# Altium project MainBay_v2.2.PrjPCB
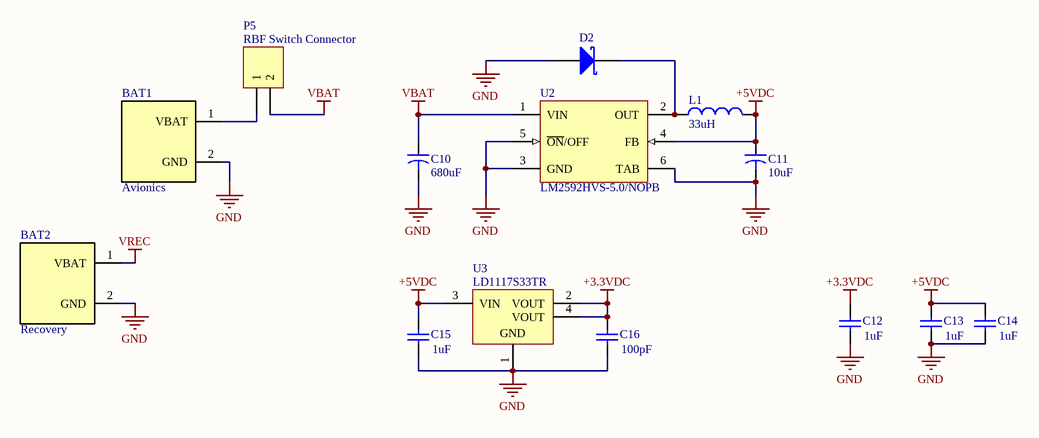
[diagram p0: PowerSys.SchDoc]
3 sheets, 55 parts. Net scope: global (net labels, ports and power ports of the same name join across sheets).
Board file: MainBay_v2.2_PCB.PcbDoc
Sheets:
  PowerSys.SchDoc
  Microcontroller.SchDoc
  Sensors.SchDoc

## Sheet PowerSys.SchDoc: Power Regulation
size A4; Revision: 2.2

### Parts
BAT1  Avionics  [XT30]
BAT2  Recovery  [XT30]
C10  value 680uF  [*CAPAE430X550N]  (hidden comment: Cap2)
C11  value 10uF  [*CAPAE430X550N]  (hidden comment: Cap2)
C12  value 1uF  [1608[0603]]  (hidden comment: Cap Semi)
C13  value 1uF  [1608[0603]]  (hidden comment: Cap Semi)
C14  value 1uF  [1608[0603]]  (hidden comment: Cap Semi)
C15  value 1uF  [C1206]  (hidden comment: Cap Semi)
C16  value 100pF  [C1206]  (hidden comment: Cap Semi)
D2  D Schottky  [SMB]  (value not drawn)
L1  33uH  [Inductor]
P5  RBF Switch Connector  [HDR1X2]
U2  LM2592HVS-5.0/NOPB  [TS5B_N]
U3  LD1117S33TR  [SOT-223_N]

### Nets
+3.3VDC: C12.2 C16.2 U3.2(VOUT) U3.4(VOUT)
+5VDC: C11.1 C13.2 C14.2 C15.2 L1.1 U2.4(FB) U3.3(VIN)
GND: BAT1.2(GND) BAT2.2(GND) C10.2 C11.2 C12.1 C13.1 C14.1 C15.1 C16.1 D2.1(A) U2.3(GND) U2.5(~{ON}/OFF) U2.6(TAB) U3.1(GND)
VBAT: C10.1 P5.2 U2.1(VIN)
VREC: BAT2.1(VBAT)
NetBAT1_1: BAT1.1(VBAT) P5.1
NetD2_2: D2.2(K) L1.2 U2.2(OUT)

### Library data of the parts
BAT1 BAT2 = XT30
C10 C11 = Cap2: Capacitor; Published: 23-Sep-2002; PackageReference: CAPR5-4X5; Publisher: Altium Limited; PackageDescription: Capacitor; 2 Leads
C12-C16 = Cap Semi: Capacitor (Semiconductor SIM Model); Published: 8-Jun-2000; LatestRevisionDate: 29-May-2009; LatestRevisionNote: IPC-7351 Footprint Added.; PackageReference: C1206; Publisher: Altium Limited; PackageDescription: Chip Capacitor
D2 = D Schottky: Schottky Diode; Published: 8-Jun-2000; LatestRevisionDate: 17-Jul-2002; LatestRevisionNote: Re-released for DXP Platform.; PackageReference: SMB; Publisher: Altium Limited; PackageDescription: DO-214-AA/SMB; 2 C-Bend Leads; Body 5.3 x 3.6 mm, inc. leads (LxW); Code_JEDEC: DO-214-AA
L1 = Inductor
P5 = Header 2: Header, 2-Pin; LatestRevisionDate: 17-Jul-2002; LatestRevisionNote: Re-released for DXP Platform.; Publisher: Altium Limited
U2 = LM2592HVS-5.0/NOPB: SIMPLE SWITCHER® Power Converter 150 KHz 2A Step-Down Voltage Regulator, 5-pin TO-263, Pb-Free; Manufacturer: National Semiconductor; PackageTopMarking: NSUZXYTTE#*LM2592HVS*-5.0 P+; PowerWise: N; Published: 1-Mar-2010; DatasheetVersion: Aug-2001; PackageVersion: revD, Apr-2005; PackageReference: TS5B; Publisher: Altium Limited; PackageDescription: TO-263, Molded, .400 x .390 x .180in, 5 Lead, .067in Pitch, Surface Mount; Supplier 1: Digi-Key; Supplier Part Number 1: LM2592HVS-5.0-ND; Supplier 2: Farnell; Supplier Part Number 2: 1469187; PartNumber: LM2592HVS-5.0/NOPB; RoHS: Y; PinCount: 5; CompType: Switcher; Code_JEDEC: MO-169-AB; ComponentLink1Description: LM2592HV Datasheet; ComponentLink1URL: http://www.national.com/ds/LM/LM2592HV.pdf; ComponentLink2Description: LM2592HV Web Page; ComponentLink2URL: http://www.national.com/pf/LM/LM2592HV.html; ComponentLink3Description: TS5B Package Page; ComponentLink3URL: http://www.national.com/packaging/folders/ts5b.html
U3 = LD1117S33TR: Fixed Low Drop Positive Voltage Regulator, 3.3V, 4-Pin SOT-223, Tape and Reel; DatasheetVersion: Nov-2011; PackageVersion: 2010; PackageReference: SOT-223; PackageDescription: 4-Pin SOT-223 Package, 6.5 x 3.5 mm Body, 2.3 mm Pitch, 7 mm Lead Span; PartNumber: LD1117S33TR; ComponentLink1Description: Manufacturer URL; ComponentLink1URL: http://www.st.com; ComponentLink2Description: Datasheet; ComponentLink2URL: http://www.st.com/internet/com/TECHNICAL_RESOURCES/TECHNICAL_LITERATURE/DATASHEET/CD00000544.pdf

## Sheet Microcontroller.SchDoc: Microcontroller Base
size A4; Revision: 2.2
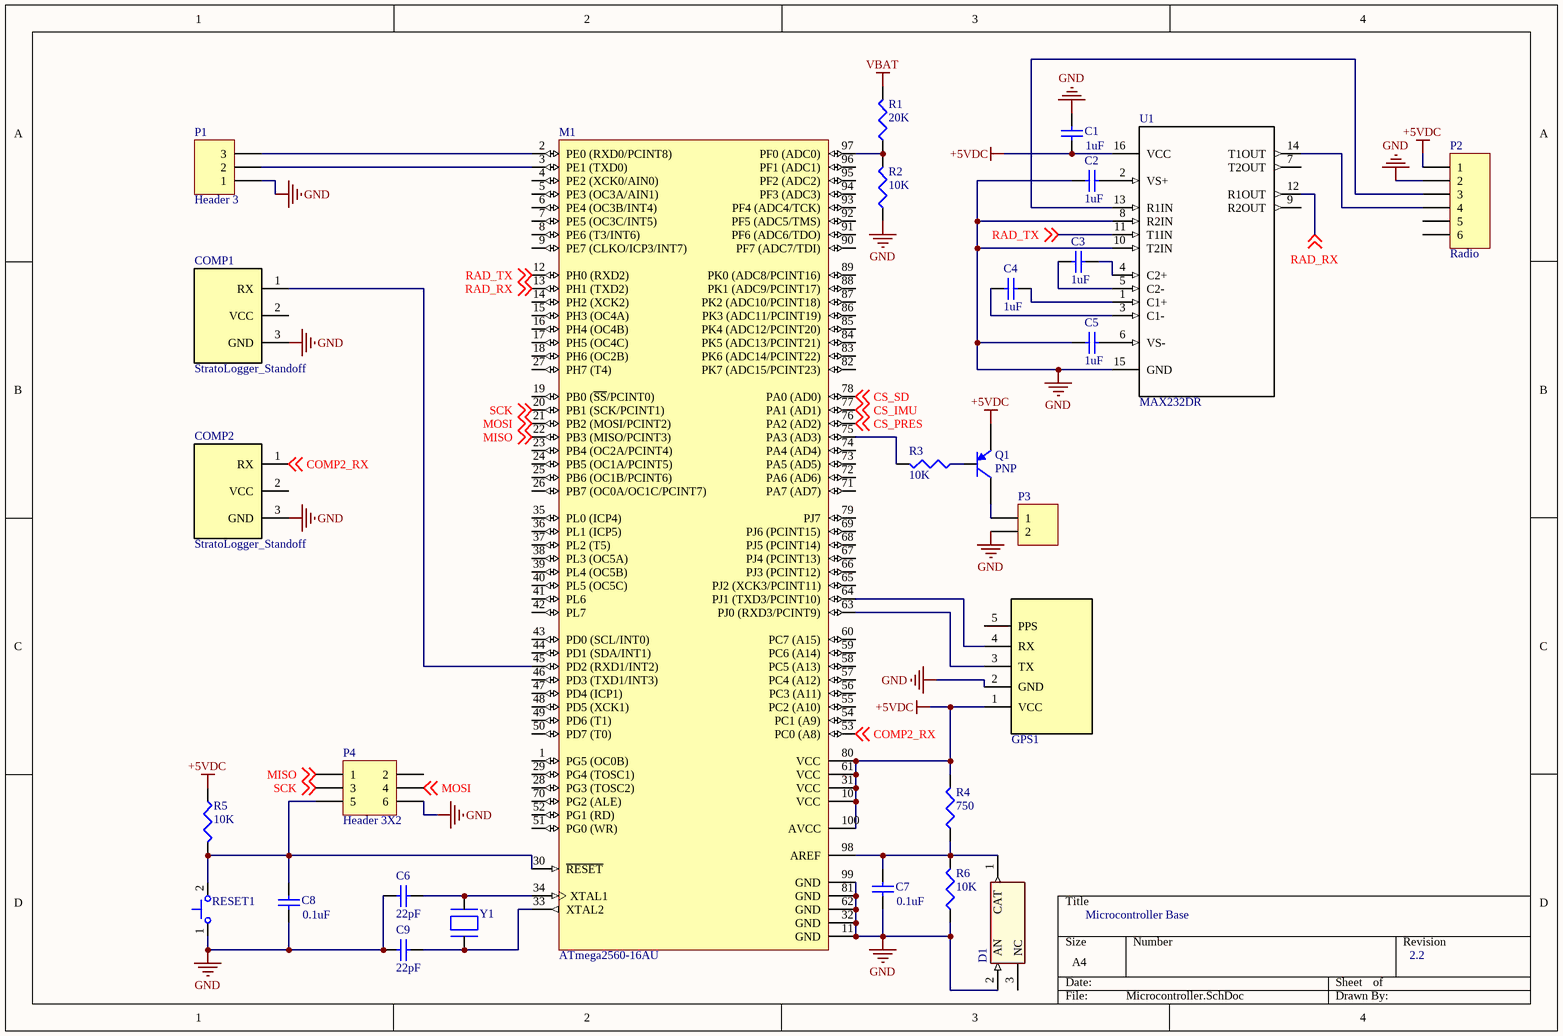
[diagram p1: Microcontroller.SchDoc]

### Parts
C1  value 1uF  [1608[0603]]  (hidden comment: Cap Semi)
C2  value 1uF  [1608[0603]]  (hidden comment: Cap Semi)
C3  value 1uF  [1608[0603]]  (hidden comment: Cap Semi)
C4  value 1uF  [1608[0603]]  (hidden comment: Cap Semi)
C5  value 1uF  [1608[0603]]  (hidden comment: Cap Semi)
C6  value 22pF  [1608[0603]]  (hidden comment: Cap Semi)
C7  value 0.1uF  [1608[0603]]  (hidden comment: Cap Semi)
C8  value 0.1uF  [1608[0603]]  (hidden comment: Cap Semi)
C9  value 22pF  [1608[0603]]  (hidden comment: Cap Semi)
COMP1  StratoLogger_Standoff  [StratoLogger_S]
COMP2  StratoLogger_Standoff  [StratoLogger_S]
D1  LM4040A82IDBZR  [SOT95P237X112-3N]  (value not drawn)
GPS1  Neo 6M GPS  [Neo 6M GPS]  (value not drawn)
M1  ATmega2560-16AU  [100A_N]
P1  Header 3  [HDR1X3]
P2  Radio  [HDR1X6]
P3  Header 2  [HDR1X2]  (value not drawn)
P4  Header 3X2  [HDR2X3]
Q1  PNP  [SOT-23B_N]
R1  value 20K  [J1-0603]  (hidden comment: Res3)
R2  value 10K  [J1-0603]  (hidden comment: Res3)
R3  value 10K  [J1-0603]  (hidden comment: Res3)
R4  value 750  [J1-0603]  (hidden comment: Res3)
R5  value 10K  [J1-0603]  (hidden comment: Res3)
R6  value 10K  [J1-0603]  (hidden comment: Res3)
RESET1  KSS221GLFS  [KSS-2G]  (value not drawn)
U1  MAX232DR  [SOIC127P600X175-16N]
Y1  Crystal SMD  [Crystal SMD]  (value not drawn)

### Nets
+5VDC: C1.1 GPS1.1(VCC) M1.10(VCC) M1.31(VCC) M1.61(VCC) M1.80(VCC) M1.100(AVCC) P2.1 Q1.3(E) R4.2 R5.1 U1.16(VCC)
GND: C1.2 C2.2 C5.2 C6.1 C7.1 C8.1 C9.1 COMP1.3(GND) COMP2.3(GND) D1.2(AN) GPS1.2(GND) M1.11(GND) M1.32(GND) M1.62(GND) M1.81(GND) M1.99(GND) P1.1 P2.2 P3.2 P4.6 R2.1 R6.1 RESET1.1 U1.8(R2IN) U1.10(T2IN) U1.15(GND)
VBAT: R1.2
COMP2_RX: COMP2.1(RX) M1.53(PC0_(A8)) ; off-sheet COMP2_RX
CS_IMU: M1.77(PA1_(AD1)) ; off-sheet CS_IMU
CS_PRES: M1.76(PA2_(AD2)) ; off-sheet CS_PRES
CS_SD: M1.78(PA0_(AD0)) ; off-sheet CS_SD
MISO: M1.22(PB3_(MISO/PCINT3)) P4.1 ; off-sheet MISO
MOSI: M1.21(PB2_(MOSI/PCINT2)) P4.4 ; off-sheet MOSI
RAD_RX: M1.13(PH1_(TXD2)) U1.12(R1OUT) ; off-sheet RAD_RX
RAD_TX: M1.12(PH0_(RXD2)) U1.11(T1IN) ; off-sheet RAD_TX
SCK: M1.20(PB1_(SCK/PCINT1)) P4.3 ; off-sheet SCK
NetC2_1: C2.1 U1.2(VS+)
NetC3_1: C3.1 U1.4(C2+)
NetC3_2: C3.2 U1.5(C2-)
NetC4_1: C4.1 U1.1(C1+)
NetC4_2: C4.2 U1.3(C1-)
NetC5_1: C5.1 U1.6(VS-)
NetC6_2: C6.2 M1.34(XTAL1) Y1.1
NetC7_2: C7.2 D1.1(CAT) M1.98(AREF) R4.1 R6.2
NetC8_2: C8.2 M1.30(~{RESET}) P4.5 R5.2 RESET1.2
NetC9_2: C9.2 M1.33(XTAL2) Y1.2
NetCOMP1_1: COMP1.1(RX) M1.45(PD2_(RXD1/INT2))
NetGPS1_3: GPS1.3(TX) M1.63(PJ0_(RXD3/PCINT9))
NetGPS1_4: GPS1.4(RX) M1.64(PJ1_(TXD3/PCINT10))
NetM1_2: M1.2(PE0_(RXD0/PCINT8)) P1.3
NetM1_3: M1.3(PE1_(TXD0)) P1.2
NetM1_75: M1.75(PA3_(AD3)) R3.2
NetM1_97: M1.97(PF0_(ADC0)) R1.1 R2.2
NetP2_3: P2.3 U1.13(R1IN)
NetP2_4: P2.4 U1.14(T1OUT)
NetP3_1: P3.1 Q1.1(C)
NetQ1_2: Q1.2(B) R3.1

Not connected (* = marked no-connect by the designer): COMP1 2(VCC); COMP2 2(VCC); D1 3(NC); GPS1 5(PPS); M1 1(PG5_(OC0B)) 4(PE2_(XCK0/AIN0)) 5(PE3_(OC3A/AIN1)) 6(PE4_(OC3B/INT4)) 7(PE5_(OC3C/INT5)) 8(PE6_(T3/INT6)) 9(PE7_(CLKO/ICP3/INT7)) 14(PH2_(XCK2)) 15(PH3_(OC4A)) 16(PH4_(OC4B)) 17(PH5_(OC4C)) 18(PH6_(OC2B)) 19(PB0_(~{SS}/PCINT0)) 23(PB4_(OC2A/PCINT4)) 24(PB5_(OC1A/PCINT5)) 25(PB6_(OC1B/PCINT6)) 26(PB7_(OC0A/OC1C/PCINT7)) 27(PH7_(T4)) 28(PG3_(TOSC2)) 29(PG4_(TOSC1)) 35(PL0_(ICP4)) 36(PL1_(ICP5)) 37(PL2_(T5)) 38(PL3_(OC5A)) 39(PL4_(OC5B)) 40(PL5_(OC5C)) 41(PL6) 42(PL7) 43(PD0_(SCL/INT0)) 44(PD1_(SDA/INT1)) 46(PD3_(TXD1/INT3)) 47(PD4_(ICP1)) 48(PD5_(XCK1)) 49(PD6_(T1)) 50(PD7_(T0)) 51(PG0_(WR)) 52(PG1_(RD)) 54(PC1_(A9)) 55(PC2_(A10)) 56(PC3_(A11)) 57(PC4_(A12)) 58(PC5_(A13)) 59(PC6_(A14)) 60(PC7_(A15)) 65(PJ2_(XCK3/PCINT11)) 66(PJ3_(PCINT12)) 67(PJ4_(PCINT13)) 68(PJ5_(PCINT14)) 69(PJ6_(PCINT15)) 70(PG2_(ALE)) 71(PA7_(AD7)) 72(PA6_(AD6)) 73(PA5_(AD5)) 74(PA4_(AD4)) 79(PJ7) 82(PK7_(ADC15/PCINT23)) 83(PK6_(ADC14/PCINT22)) 84(PK5_(ADC13/PCINT21)) 85(PK4_(ADC12/PCINT20)) 86(PK3_(ADC11/PCINT19)) 87(PK2_(ADC10/PCINT18)) 88(PK1_(ADC9/PCINT17)) 89(PK0_(ADC8/PCINT16)) 90(PF7_(ADC7/TDI)) 91(PF6_(ADC6/TDO)) 92(PF5_(ADC5/TMS)) 93(PF4_(ADC4/TCK)) 94(PF3_(ADC3)) 95(PF2_(ADC2)) 96(PF1_(ADC1)); P2 5 6; P4 2; U1 7(T2OUT) 9(R2OUT)

### Library data of the parts
C1-C9 = Cap Semi: Capacitor (Semiconductor SIM Model); Published: 8-Jun-2000; LatestRevisionDate: 29-May-2009; LatestRevisionNote: IPC-7351 Footprint Added.; PackageReference: C1206; Publisher: Altium Limited; PackageDescription: Chip Capacitor
D1 = LM4040A82IDBZR: Precision Micropower Shunt Voltage Reference, 0.1% accuracy 3-SOT-23 -40 to 85; MF: Texas Instruments; Availability: Unavailable; Package: SOT-23-3 Texas Instruments; Price: None; SnapEDA_Link: https://www.snapeda.com/parts/LM4040A82IDBZR/Texas%20Instruments/view-part/?ref=snap; MP: LM4040A82IDBZR; Value: *
M1 = ATmega2560-16AU: 8-bit AVR Microcontroller, 4.5-5.5V, 256KB Flash, 4KB EEPROM, 8KB SRAM, 86 GPIO pins, 100-pin TQFP, Industrial Grade (-40°C to 85°C), Pb-Free; Published: 1-Apr-2010; DatasheetVersion: revL, Aug-2007; PackageVersion: revC, Oct-2001; PackageReference: 100A; Publisher: Altium Limited; PackageDescription: 100-Pin Thin Profile Plastic Quad Flat Pack (TQFP), 14 x 14 x 1.0 mm Body, 0.5 mm Pitch; Supplier 1: Digi-Key; Supplier Part Number 1: ATMEGA2560-16AU-ND; Supplier 2: Farnell; Supplier Part Number 2: 1288330; Supplier 3: Farnell; Supplier Part Number 3: 1661740; Supplier 4: Mouser; Supplier Part Number 4: 556-ATMEGA2560-16AU; Code_JEDEC: MS-026-AED; ComponentLink1Description: Manufacturer Link; ComponentLink1URL: http://www.atmel.com/products/avr/default.asp?; ComponentLink2Description: ATmega640/1280/1281/2560/2561 Datasheet; ComponentLink2URL: http://www.atmel.com/dyn/resources/prod_documents/doc2549.pdf; ComponentLink3Description: ATmega640/1280/1281/2560/2561 Summary; ComponentLink3URL: http://www.atmel.com/dyn/resources/prod_documents/2549S.pdf; ComponentLink4Description: Atmel.com Home; ComponentLink4URL: http://www.atmel.com
P1 = Header 3: Header, 3-Pin; LatestRevisionDate: 17-Jul-2002; LatestRevisionNote: Re-released for DXP Platform.; Publisher: Altium Limited
P2 = Header 6: Header, 6-Pin; LatestRevisionDate: 17-Jul-2002; LatestRevisionNote: Re-released for DXP Platform.; Publisher: Altium Limited
P3 = Header 2: Header, 2-Pin; LatestRevisionDate: 17-Jul-2002; LatestRevisionNote: Re-released for DXP Platform.; Publisher: Altium Limited
P4 = Header 3X2: Header, 3-Pin, Dual row; LatestRevisionDate: 17-Jul-2002; LatestRevisionNote: Re-released for DXP Platform.; Publisher: Altium Limited
Q1 = PNP: PNP Bipolar Transistor; Published: 8-Jun-2000; LatestRevisionDate: 29-May-2009; LatestRevisionNote: IPC-7351 Footprint Added.; PackageVersion: Aug-1999; PackageReference: SOT-23B; Publisher: Altium Limited; PackageDescription: 3-Pin SOT-23 Package 0.95 mm Pitch, 2.4 mm Lead Span
R1-R6 = Res3: Resistor; Published: 8-Jun-2000; LatestRevisionDate: 29-May-2009; LatestRevisionNote: IPC-7351 Footprint Added.; PackageReference: J1-0603; Publisher: Altium Limited; PackageDescription: Chip Resistor
RESET1 = KSS221GLFS: Switch, Subminiature Side-Actuated Tact, SMT, KSS Series, Std Actuator, 2 Gull Wing Leads, SPST, 2N Force, Silver Contact; PCB_Layout: Complies with manufacturer's recommendation.; Published: 14-Mar-2008; DatasheetVersion: Aug-2007; PackageVersion: Aug-2007; PackageReference: KSS-2G; Publisher: Altium Limited; PackageDescription: Subminiature SMT Side Actuated Switch, Body 7 x 3.5 mm (LxW); ComponentLink1Description: Manufacturer Link; ComponentLink1URL: http://www.ck-components.com/; ComponentLink2Description: Datasheet; ComponentLink2URL: http://www.ck-components.com/media/pdf/catalogs/Tactile_Switches%5CKSS_series_Tactile_August_2007.pdf
U1 = MAX232DR: Single Supply Voltage, RS-232 Transceiver; MF: Texas Instruments; MP: MAX232DR; SnapEDA_Link: https://www.snapeda.com/parts/MAX232DR/Texas%20Instruments/view-part/?ref=snap; Availability: Unavailable; Package: SOIC-16 Chipswinner; Price: None; Value: *

## Sheet Sensors.SchDoc
size A
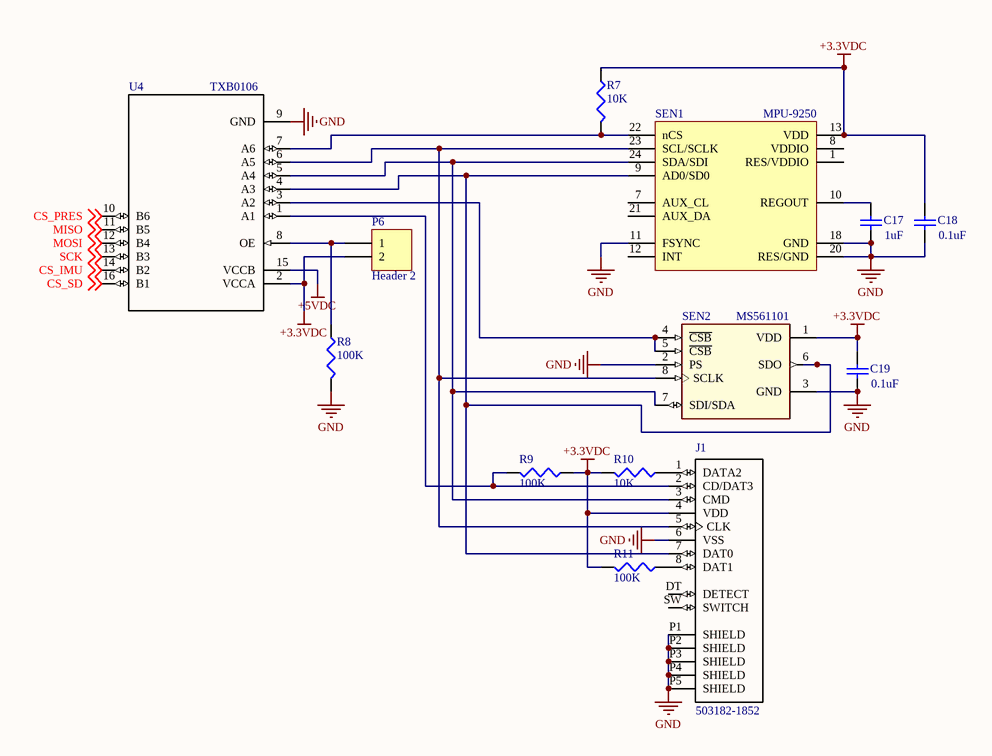
[diagram p2: Sensors.SchDoc]

### Parts
C17  value 1uF  [1608[0603]]  (hidden comment: Cap Semi)
C18  value 0.1uF  [1608[0603]]  (hidden comment: Cap Semi)
C19  value 0.1uF  [1608[0603]]  (hidden comment: Cap Semi)
J1  503182-1852  [MOLEX_503182-1852_503182-1852(Primary)]
P6  Header 2  [HDR1X2]
R7  value 10K  [J1-0603]  (hidden comment: Res3)
R8  value 100K  [J1-0603]  (hidden comment: Res3)
R9  value 100K  [J1-0603]  (hidden comment: Res3)
R10  value 10K  [J1-0603]  (hidden comment: Res3)
R11  value 100K  [J1-0603]  (hidden comment: Res3)
SEN1  MPU-9250  [QFN40P300X300X105_HS-25L]
SEN2  MS561101  [SON125P500X300X100-8N]
U4  TXB0106  [SOP65P640X120-16N]

### Nets
+3.3VDC: C18.2 C19.2 J1.4(VDD) P6.2 R7.1 R9.1 R10.2 R11.2 SEN1.13(VDD) SEN2.1(VDD) U4.2(VCCA)
+5VDC: U4.15(VCCB)
GND: C17.1 C18.1 C19.1 J1.6(VSS) J1.P1(SHIELD) J1.P2(SHIELD) J1.P3(SHIELD) J1.P4(SHIELD) J1.P5(SHIELD) R8.2 SEN1.11(FSYNC) SEN1.18(GND) SEN1.20(RES/GND) SEN2.2(PS) SEN2.3(GND) U4.9(GND)
CS_IMU: U4.14(B2) ; off-sheet CS_IMU
CS_PRES: U4.10(B6) ; off-sheet CS_PRES
CS_SD: U4.16(B1) ; off-sheet CS_SD
MISO: U4.11(B5) ; off-sheet MISO
MOSI: U4.12(B4) ; off-sheet MOSI
SCK: U4.13(B3) ; off-sheet SCK
NetC17_2: C17.2 SEN1.10(REGOUT)
NetJ1_1: J1.1(DATA2) R10.1
NetJ1_2: J1.2(CD/DAT3) R9.2 U4.1(A1)
NetJ1_3: J1.3(CMD) SEN1.24(SDA/SDI) SEN2.7(SDI/SDA) U4.5(A4)
NetJ1_5: J1.5(CLK) SEN1.23(SCL/SCLK) SEN2.8(SCLK) U4.6(A5)
NetJ1_7: J1.7(DAT0) SEN1.9(AD0/SD0) SEN2.6(SDO) U4.4(A3)
NetJ1_8: J1.8(DAT1) R11.1
NetP6_1: P6.1 R8.1 U4.8(OE)
NetR7_2: R7.2 SEN1.22(nCS) U4.7(A6)
NetSEN2_4: SEN2.4(~{CSB}) SEN2.5(~{CSB}) U4.3(A2)

Not connected (* = marked no-connect by the designer): J1 DT(DETECT) SW(SWITCH); SEN1 1(RES/VDDIO) 7(AUX_CL) 8(VDDIO) 12(INT) 21(AUX_DA)

### Library data of the parts
C17-C19 = Cap Semi: Capacitor (Semiconductor SIM Model); Published: 8-Jun-2000; LatestRevisionDate: 29-May-2009; LatestRevisionNote: IPC-7351 Footprint Added.; PackageReference: C1206; Publisher: Altium Limited; PackageDescription: Chip Capacitor
J1 = microSD Slot: Conn Micro SD Card M 8 POS 1.09mm Solder RA SMD Embossed T/R 0.5A/Contact; MF: Molex; Package: None; MP: 503182-1852; Price: None; Availability: Unavailable; SnapEDA_Link: https://www.snapeda.com/parts/503182-1852/Molex/view-part/?ref=snap; Value: *
P6 = Header 2: Header, 2-Pin; LatestRevisionDate: 17-Jul-2002; LatestRevisionNote: Re-released for DXP Platform.; Publisher: Altium Limited
R7-R11 = Res3: Resistor; Published: 8-Jun-2000; LatestRevisionDate: 29-May-2009; LatestRevisionNote: IPC-7351 Footprint Added.; PackageReference: J1-0603; Publisher: Altium Limited; PackageDescription: Chip Resistor
SEN2 = MS561101BA03-50: Pressure Sensor 1.44V to 3.6V 0.01bar to 1.2bar Absolute 8-Pin QFN T/R; MF: TE Connectivity; Price: None; Package: SMD-8 Measurement Specialties; TE_purchase_URL: https://www.te.com/usa-en/product-MS561101BA03-50.html?te_bu=Cor&te_type=disp&te_campaign=seda_glo_cor-seda-global-disp-prtnr-fy19-seda-model-bom-cta_sma-317_1&elqCampaignId=32493; SnapEDA_Link: https://www.snapeda.com/parts/MS561101BA03-50/TE%20Connectivity%20ALCOSWITCH%20Switches/view-part/?ref=snap; Availability: Unavailable; MP: MS561101BA03-50; Value: *
U4 = TXB0106PWR: 6-Bit Bidirectional Voltage-Level Translator with Auto Direction Sensing and +/-15-kV ESD Protect 16-TSSOP -40 to 85; MF: Texas Instruments; Price: None; MP: TXB0106PWR; Availability: Unavailable; SnapEDA_Link: https://www.snapeda.com/parts/TXB0106PWR/Texas%20Instruments/view-part/?ref=snap; Package: TSSOP-16 Texas Instruments; Value: *

## Nets that join several sheets
+3.3VDC: PowerSys (C12.2 C16.2 U3.2 U3.4), Sensors (11 pins)
+5VDC: PowerSys (7 pins), Microcontroller (12 pins), Sensors (U4.15)
GND: PowerSys (14 pins), Microcontroller (26 pins), Sensors (16 pins)
VBAT: PowerSys (C10.1 P5.2 U2.1), Microcontroller (R1.2)
CS_IMU: Microcontroller (M1.77), Sensors (U4.14)
CS_PRES: Microcontroller (M1.76), Sensors (U4.10)
CS_SD: Microcontroller (M1.78), Sensors (U4.16)
MISO: Microcontroller (M1.22 P4.1), Sensors (U4.11)
MOSI: Microcontroller (M1.21 P4.4), Sensors (U4.12)
SCK: Microcontroller (M1.20 P4.3), Sensors (U4.13)